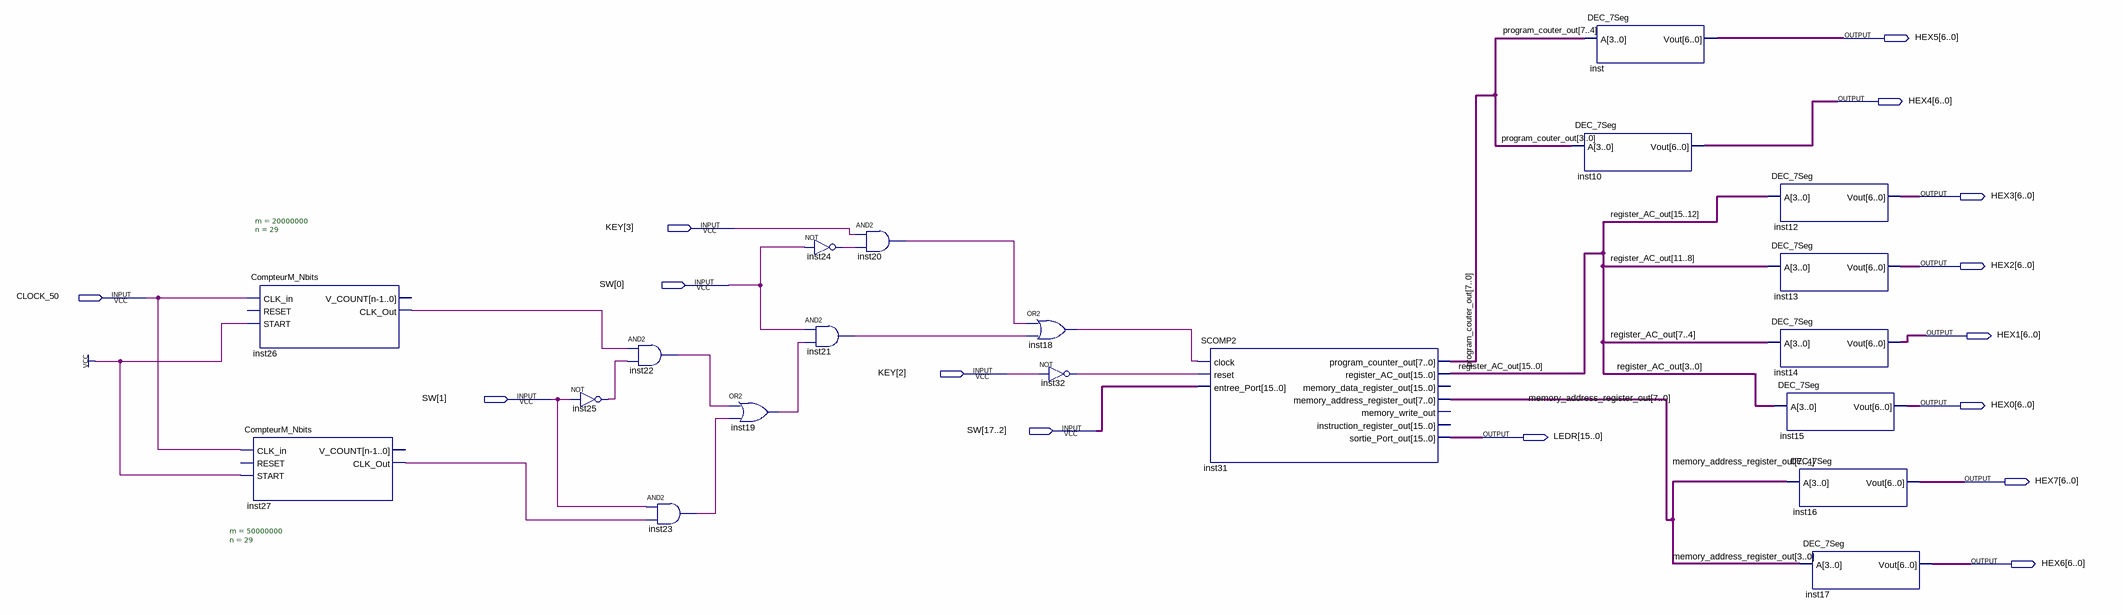
[diagram p0: schematic sheet]
// Quartus schematic Processeur.bdf as structural Verilog: 20 symbols, 15 pins
module Processeur (
  input  [3:2] KEY,
  input  [17:0] SW,
  input  CLOCK_50,
  output [6:0] HEX5,
  output [6:0] HEX4,
  output [6:0] HEX3,
  output [6:0] HEX2,
  output [6:0] HEX1,
  output [6:0] HEX0,
  output [15:0] LEDR,
  output [6:0] HEX7,
  output [6:0] HEX6
);

  wire inst18_out, inst19_out, inst20_out, inst21_out, inst22_out, inst23_out, inst24_out, inst25_out,
       inst26_clk_out, inst27_clk_out, inst32_out;
  wire [7:0] memory_address_register_out, program_couter_out;
  wire [15:0] register_AC_out;

  CompteurM_Nbits #(.m(20000000), .n(29)) inst26 (
    .CLK_in(CLOCK_50), .START(1'b1), .CLK_Out(inst26_clk_out));  // open: RESET, V_COUNT
  CompteurM_Nbits #(.m(50000000), .n(29)) inst27 (
    .CLK_in(CLOCK_50), .START(1'b1), .CLK_Out(inst27_clk_out));  // open: RESET, V_COUNT
  not inst25 (inst25_out, SW[1]);
  and inst22 (inst22_out, inst26_clk_out, inst25_out);
  and inst23 (inst23_out, SW[1], inst27_clk_out);
  or inst19 (inst19_out, inst22_out, inst23_out);
  not inst24 (inst24_out, SW[0]);
  and inst21 (inst21_out, SW[0], inst19_out);
  and inst20 (inst20_out, KEY[3], inst24_out);
  or inst18 (inst18_out, inst20_out, inst21_out);
  not inst32 (inst32_out, KEY[2]);
  SCOMP2 inst31 (
    .clock(inst18_out), .reset(inst32_out), .entree_Port(SW[17:2]), .program_counter_out(program_couter_out),
    .register_AC_out(register_AC_out), .memory_address_register_out(memory_address_register_out),
    .sortie_Port_out(LEDR));  // open: memory_data_register_out, memory_write_out, instruction_register_out
  DEC_7Seg inst (.A(program_couter_out[7:4]), .Vout(HEX5));
  DEC_7Seg inst10 (.A(program_couter_out[3:0]), .Vout(HEX4));
  DEC_7Seg inst12 (.A(register_AC_out[15:12]), .Vout(HEX3));
  DEC_7Seg inst13 (.A(register_AC_out[11:8]), .Vout(HEX2));
  DEC_7Seg inst14 (.A(register_AC_out[7:4]), .Vout(HEX1));
  DEC_7Seg inst15 (.A(register_AC_out[3:0]), .Vout(HEX0));
  DEC_7Seg inst16 (.A(memory_address_register_out[7:4]), .Vout(HEX7));
  DEC_7Seg inst17 (.A(memory_address_register_out[3:0]), .Vout(HEX6));
endmodule
